# Altium schematic sheet MCU.SchDoc
size A3; SheetNumber: 3; SheetTotal: 9
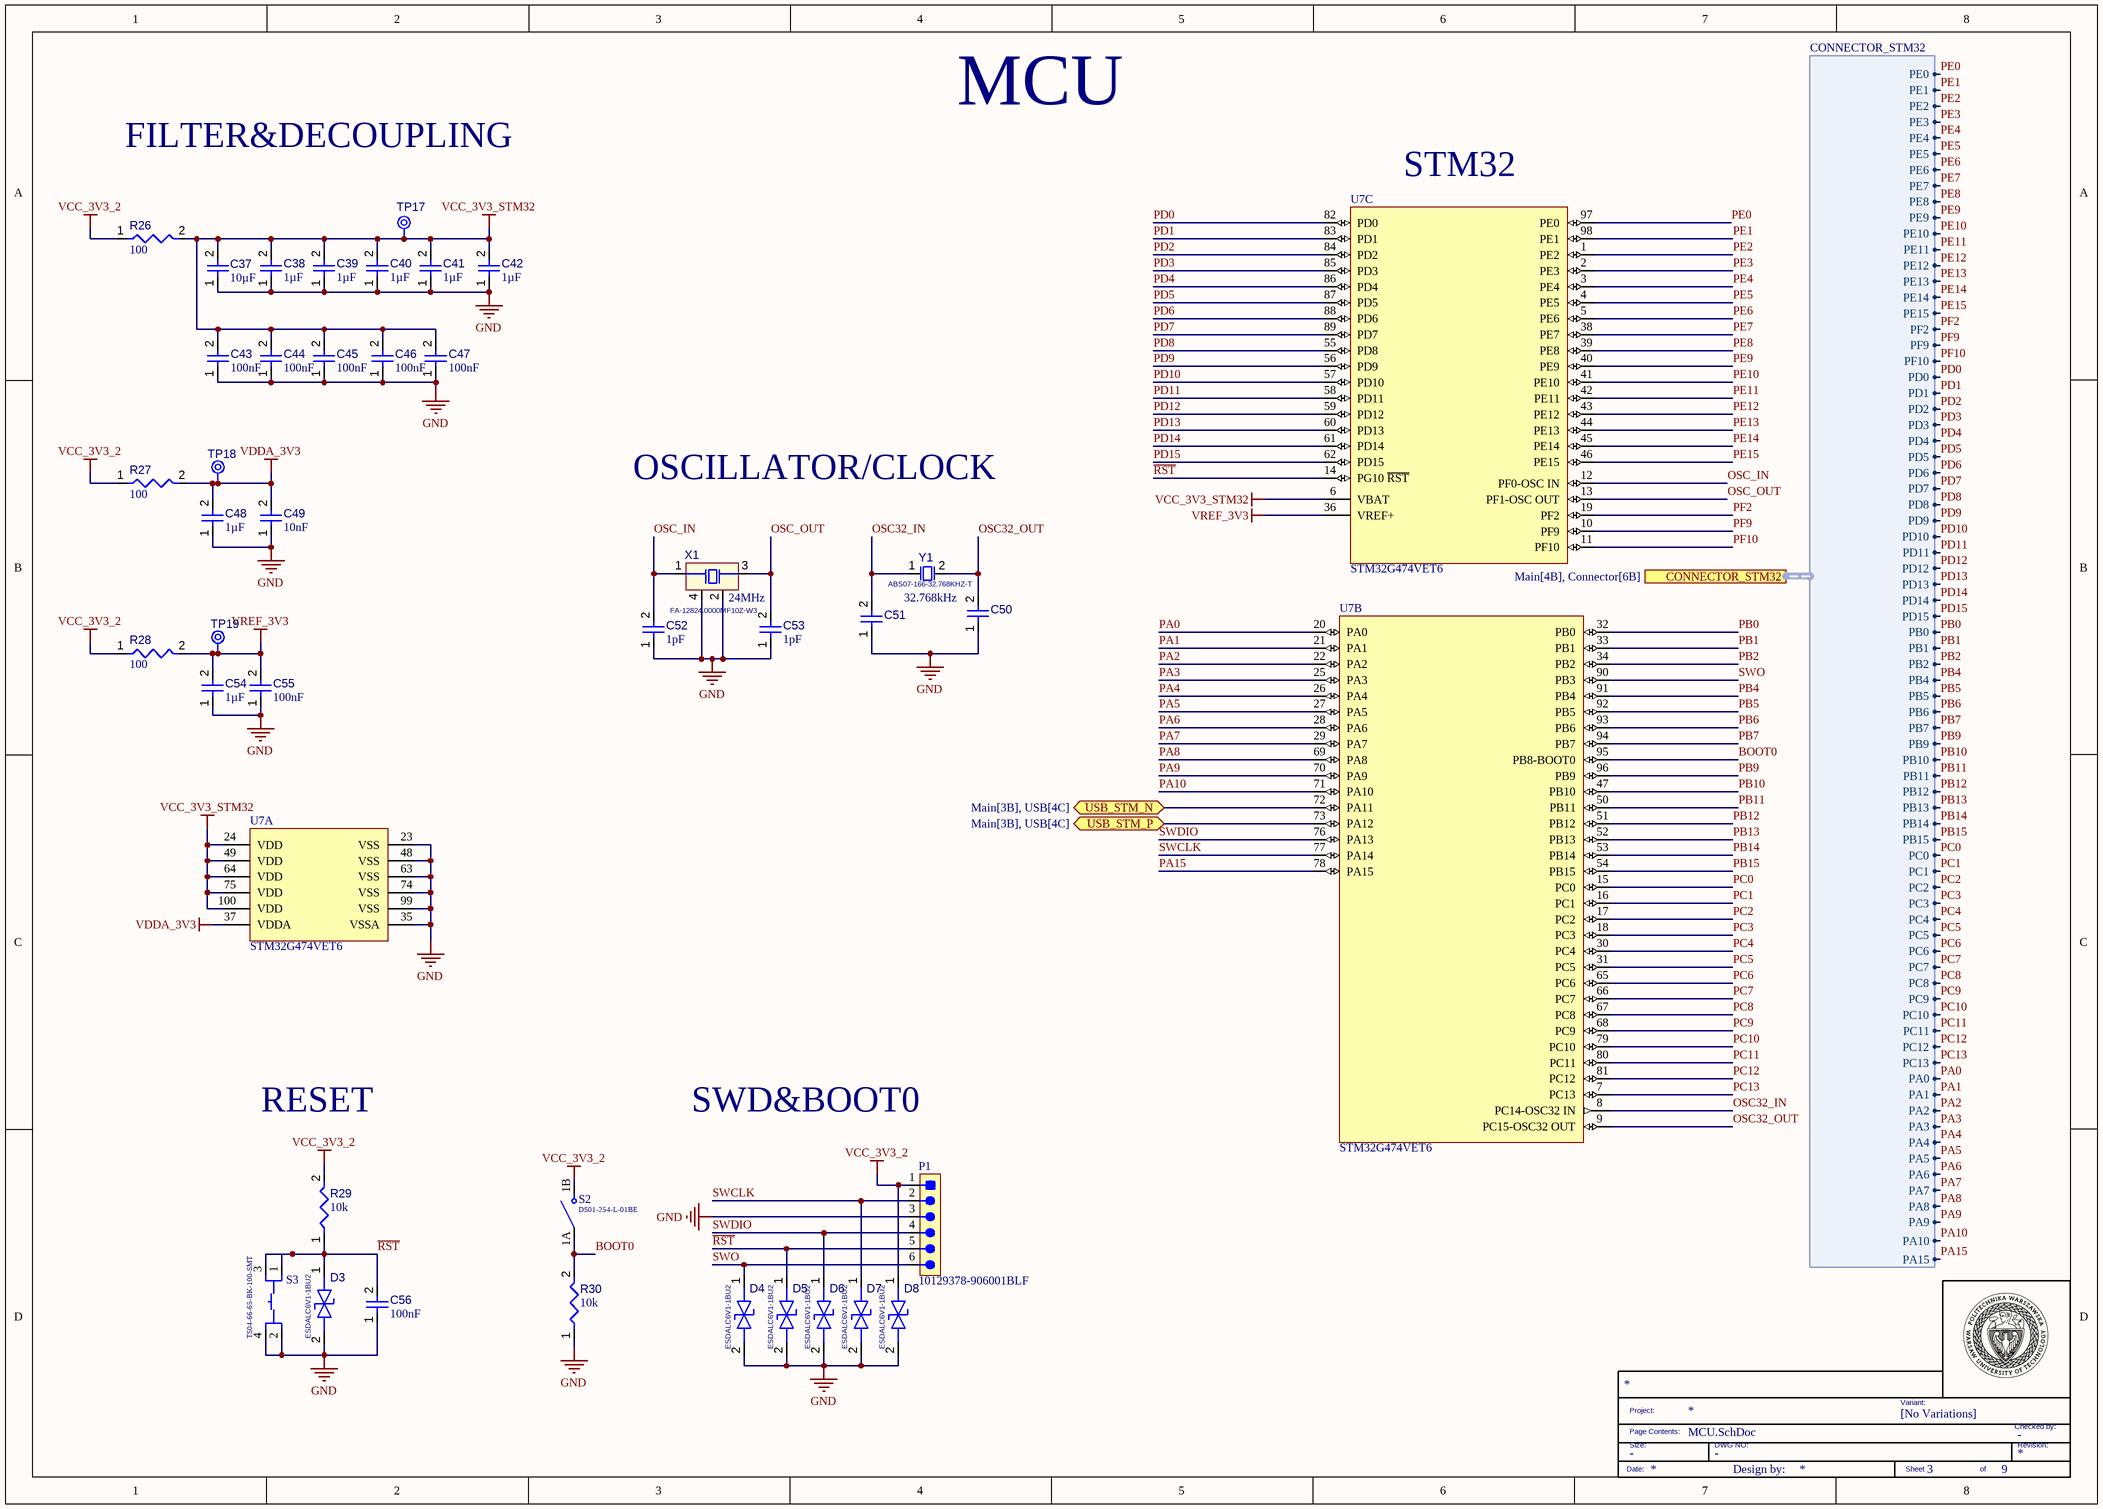
[diagram p0: MCU.SchDoc]

## Parts
*?  TITLE_BLOCK  (value not drawn)  (graphical)
C37  value 10µF  [FP-GRM188-0_2-IPC_C]  (hidden comment: GRM188R61C106MA73D)
C38  value 1µF  [FP-CL10-IPC_C]  (hidden comment: CL10B105KA8NFNC)
C39  value 1µF  [FP-CL10-IPC_C]  (hidden comment: CL10B105KA8NFNC)
C40  value 1µF  [FP-CL10-IPC_C]  (hidden comment: CL10B105KA8NFNC)
C41  value 1µF  [FP-CL10-IPC_C]  (hidden comment: CL10B105KA8NFNC)
C42  value 1µF  [FP-CL10-IPC_C]  (hidden comment: CL10B105KA8NFNC)
C43  value 100nF  [FP-C0603C-CF-IPC_C]  (hidden comment: C0603C104K5RAC7411)
C44  value 100nF  [FP-C0603C-CF-IPC_C]  (hidden comment: C0603C104K5RAC7411)
C45  value 100nF  [FP-C0603C-CF-IPC_C]  (hidden comment: C0603C104K5RAC7411)
C46  value 100nF  [FP-C0603C-CF-IPC_C]  (hidden comment: C0603C104K5RAC7411)
C47  value 100nF  [FP-C0603C-CF-IPC_C]  (hidden comment: C0603C104K5RAC7411)
C48  value 1µF  [FP-CL10-IPC_C]  (hidden comment: CL10B105KA8NFNC)
C49  value 10nF  [CAPC1608X90X35LL10T15]  (hidden comment: GCM188R71H103KA37J)
C50  C0402C479D8HACAUTO  [FP-C0402-BB-MFG]  (value not drawn)
C51  C0402C479D8HACAUTO  [FP-C0402-BB-MFG]  (value not drawn)
C52  value 1pF  [CAPC1005X06N]  (hidden comment: CBR04C109B5GACAUTO)
C53  value 1pF  [CAPC1005X06N]  (hidden comment: CBR04C109B5GACAUTO)
C54  value 1µF  [FP-CL10-IPC_C]  (hidden comment: CL10B105KA8NFNC)
C55  value 100nF  [FP-C0603C-CF-IPC_C]  (hidden comment: C0603C104K5RAC7411)
C56  value 100nF  [FP-C0603C-CF-IPC_C]  (hidden comment: C0603C104K5RAC7411)
D3  ESDALC6V1-1BU2  [DIOC0603X03N]
D4  ESDALC6V1-1BU2  [DIOC0603X03N]
D5  ESDALC6V1-1BU2  [DIOC0603X03N]
D6  ESDALC6V1-1BU2  [DIOC0603X03N]
D7  ESDALC6V1-1BU2  [DIOC0603X03N]
D8  ESDALC6V1-1BU2  [DIOC0603X03N]
P1  10129378-906001BLF  [10129378-906001BLF-Footprint-1]
R26  value 100  [RESC1608X06N]  (hidden comment: CRCW0603100RFKEAHP)
R27  value 100  [RESC1608X06N]  (hidden comment: CRCW0603100RFKEAHP)
R28  value 100  [RESC1608X06N]  (hidden comment: CRCW0603100RFKEAHP)
R29  value 10k  [RESC1608X05N]  (hidden comment: CRCW060310K0FKTC)
R30  value 10k  [RESC1608X05N]  (hidden comment: CRCW060310K0FKTC)
S2  DS01-254-L-01BE  [SW_DS01-254-L-01BE]
S3  TS04-66-65-BK-100-SMT  [SW_TS04-66-65-BK-100-SMT]
TP17  TPAD6R  [TP06R]  (value not drawn)  (no BOM)
TP18  TPAD6R  [TP06R]  (value not drawn)  (no BOM)
TP19  TPAD6R  [TP06R]  (value not drawn)  (no BOM)
U7  STM32G474VET6  [FP-LQFP100-1L-IPC_B]  (parts A,B,C of 3)
X1  FA-12824.0000MF10Z-W3  Frequency: 24MHz  [EPSON-FA-128_V]
Y1  ABS07-166-32.768KHZ-T  Frequency: 32.768kHz  [EPSON-FC-135_V]

## Ports
CONNECTOR_STM32 (harness CONNECTOR_STM32, see Main[4B], Connector[6B]), USB_STM_N (bidir, see Main[3B], USB[4C]), USB_STM_P (bidir, see Main[3B], USB[4C])

## Harnesses
CONNECTOR_STM32: PE0, PE1, PE2, PE3, PE4, PE5, PE6, PE7, PE8, PE9, PE10, PE11, PE12, PE13, PE14, PE15, PF2, PF9, PF10, PD0, PD1, PD2, PD3, PD4, PD5, PD6, PD7, PD8, PD9, PD10, PD11, PD12, PD13, PD14, PD15, PB0, PB1, PB2, PB4, PB5, PB6, PB7, PB9, PB10, PB11, PB12, PB13, PB14, PB15, PC0, PC1, PC2, PC3, PC4, PC5, PC6, PC7, PC8, PC9, PC10, PC11, PC12, PC13, PA0, PA1, PA2, PA3, PA4, PA5, PA6, PA7, PA8, PA9, PA10, PA15

## Nets
GND: C37.1 C38.1 C39.1 C40.1 C41.1 C42.1 C43.1 C44.1 C45.1 C46.1 C47.1 C48.1 C49.1 C50.1 C51.1 C52.1 C53.1 C54.1 C55.1 C56.1 D3.2(A) D4.2(A) D5.2(A) D6.2(A) D7.2(A) D8.2(A) P1.3 R30.1 S3.2 S3.4 U7.23(VSS) U7.35(VSSA) U7.48(VSS) U7.63(VSS) U7.74(VSS) U7.99(VSS) X1.2(NC) X1.4(NC)
VCC_3V3_2: D8.1(K) P1.1 R26.1 R27.1 R28.1 R29.2 S2.1B(NO1)
VCC_3V3_STM32: C37.2 C38.2 C39.2 C40.2 C41.2 C42.2 C43.2 C44.2 C45.2 C46.2 C47.2 R26.2 TP17.1(TP) U7.6(VBAT) U7.24(VDD) U7.49(VDD) U7.64(VDD) U7.75(VDD) U7.100(VDD)
VDDA_3V3: C48.2 C49.2 R27.2 TP18.1(TP) U7.37(VDDA)
VREF_3V3: C54.2 C55.2 R28.2 TP19.1(TP) U7.36(VREF+)
~{RST}: C56.2 D3.1(K) D5.1(K) P1.5 R29.1 S3.1 S3.3 U7.14(PG10_~{RST})
BOOT0: R30.2 S2.1A(COM1) U7.95(PB8-BOOT0)
OSC32_IN: C51.2 U7.8(PC14-OSC32_IN) Y1.1
OSC32_OUT: C50.2 U7.9(PC15-OSC32_OUT) Y1.2
OSC_IN: C52.2 U7.12(PF0-OSC_IN) X1.1(X1)
OSC_OUT: C53.2 U7.13(PF1-OSC_OUT) X1.3(X2)
PA0: U7.20(PA0) ; port CONNECTOR_STM32.PA0
PA1: U7.21(PA1) ; port CONNECTOR_STM32.PA1
PA2: U7.22(PA2) ; port CONNECTOR_STM32.PA2
PA3: U7.25(PA3) ; port CONNECTOR_STM32.PA3
PA4: U7.26(PA4) ; port CONNECTOR_STM32.PA4
PA5: U7.27(PA5) ; port CONNECTOR_STM32.PA5
PA6: U7.28(PA6) ; port CONNECTOR_STM32.PA6
PA7: U7.29(PA7) ; port CONNECTOR_STM32.PA7
PA8: U7.69(PA8) ; port CONNECTOR_STM32.PA8
PA9: U7.70(PA9) ; port CONNECTOR_STM32.PA9
PA10: U7.71(PA10) ; port CONNECTOR_STM32.PA10
PA15: U7.78(PA15) ; port CONNECTOR_STM32.PA15
PB0: U7.32(PB0) ; port CONNECTOR_STM32.PB0
PB1: U7.33(PB1) ; port CONNECTOR_STM32.PB1
PB2: U7.34(PB2) ; port CONNECTOR_STM32.PB2
PB4: U7.91(PB4) ; port CONNECTOR_STM32.PB4
PB5: U7.92(PB5) ; port CONNECTOR_STM32.PB5
PB6: U7.93(PB6) ; port CONNECTOR_STM32.PB6
PB7: U7.94(PB7) ; port CONNECTOR_STM32.PB7
PB9: U7.96(PB9) ; port CONNECTOR_STM32.PB9
PB10: U7.47(PB10) ; port CONNECTOR_STM32.PB10
PB11: U7.50(PB11) ; port CONNECTOR_STM32.PB11
PB12: U7.51(PB12) ; port CONNECTOR_STM32.PB12
PB13: U7.52(PB13) ; port CONNECTOR_STM32.PB13
PB14: U7.53(PB14) ; port CONNECTOR_STM32.PB14
PB15: U7.54(PB15) ; port CONNECTOR_STM32.PB15
PC0: U7.15(PC0) ; port CONNECTOR_STM32.PC0
PC1: U7.16(PC1) ; port CONNECTOR_STM32.PC1
PC2: U7.17(PC2) ; port CONNECTOR_STM32.PC2
PC3: U7.18(PC3) ; port CONNECTOR_STM32.PC3
PC4: U7.30(PC4) ; port CONNECTOR_STM32.PC4
PC5: U7.31(PC5) ; port CONNECTOR_STM32.PC5
PC6: U7.65(PC6) ; port CONNECTOR_STM32.PC6
PC7: U7.66(PC7) ; port CONNECTOR_STM32.PC7
PC8: U7.67(PC8) ; port CONNECTOR_STM32.PC8
PC9: U7.68(PC9) ; port CONNECTOR_STM32.PC9
PC10: U7.79(PC10) ; port CONNECTOR_STM32.PC10
PC11: U7.80(PC11) ; port CONNECTOR_STM32.PC11
PC12: U7.81(PC12) ; port CONNECTOR_STM32.PC12
PC13: U7.7(PC13) ; port CONNECTOR_STM32.PC13
PD0: U7.82(PD0) ; port CONNECTOR_STM32.PD0
PD1: U7.83(PD1) ; port CONNECTOR_STM32.PD1
PD2: U7.84(PD2) ; port CONNECTOR_STM32.PD2
PD3: U7.85(PD3) ; port CONNECTOR_STM32.PD3
PD4: U7.86(PD4) ; port CONNECTOR_STM32.PD4
PD5: U7.87(PD5) ; port CONNECTOR_STM32.PD5
PD6: U7.88(PD6) ; port CONNECTOR_STM32.PD6
PD7: U7.89(PD7) ; port CONNECTOR_STM32.PD7
PD8: U7.55(PD8) ; port CONNECTOR_STM32.PD8
PD9: U7.56(PD9) ; port CONNECTOR_STM32.PD9
PD10: U7.57(PD10) ; port CONNECTOR_STM32.PD10
PD11: U7.58(PD11) ; port CONNECTOR_STM32.PD11
PD12: U7.59(PD12) ; port CONNECTOR_STM32.PD12
PD13: U7.60(PD13) ; port CONNECTOR_STM32.PD13
PD14: U7.61(PD14) ; port CONNECTOR_STM32.PD14
PD15: U7.62(PD15) ; port CONNECTOR_STM32.PD15
PE0: U7.97(PE0) ; port CONNECTOR_STM32.PE0
PE1: U7.98(PE1) ; port CONNECTOR_STM32.PE1
PE2: U7.1(PE2) ; port CONNECTOR_STM32.PE2
PE3: U7.2(PE3) ; port CONNECTOR_STM32.PE3
PE4: U7.3(PE4) ; port CONNECTOR_STM32.PE4
PE5: U7.4(PE5) ; port CONNECTOR_STM32.PE5
PE6: U7.5(PE6) ; port CONNECTOR_STM32.PE6
PE7: U7.38(PE7) ; port CONNECTOR_STM32.PE7
PE8: U7.39(PE8) ; port CONNECTOR_STM32.PE8
PE9: U7.40(PE9) ; port CONNECTOR_STM32.PE9
PE10: U7.41(PE10) ; port CONNECTOR_STM32.PE10
PE11: U7.42(PE11) ; port CONNECTOR_STM32.PE11
PE12: U7.43(PE12) ; port CONNECTOR_STM32.PE12
PE13: U7.44(PE13) ; port CONNECTOR_STM32.PE13
PE14: U7.45(PE14) ; port CONNECTOR_STM32.PE14
PE15: U7.46(PE15) ; port CONNECTOR_STM32.PE15
PF2: U7.19(PF2) ; port CONNECTOR_STM32.PF2
PF9: U7.10(PF9) ; port CONNECTOR_STM32.PF9
PF10: U7.11(PF10) ; port CONNECTOR_STM32.PF10
SWCLK: D7.1(K) P1.2 U7.77(PA14)
SWDIO: D6.1(K) P1.4 U7.76(PA13)
SWO: D4.1(K) P1.6 U7.90(PB3)
USB_STM_N: U7.72(PA11) ; port USB_STM_N
USB_STM_P: U7.73(PA12) ; port USB_STM_P

## Notes on the sheet
- FILTER&DECOUPLING
- MCU
- (near U7) STM32
- OSCILLATOR/CLOCK
- Battery not used
- RESET
- SWD&BOOT0
- (in symbol CMP-003-000005-7) Variant:; Project:; [No Variations]; Checked by:; Page Contents:; Size:; DWG NO:; Revision:; Date:; Design by:; Sheet; of

## Library data of the parts
*? = CMP-003-000005-7: TITLEBLOCK; DWG NO: -; Size: -; Checked by: -; Design Item ID: TITLE_BLOCK; Source: TITLEBLOCK.SchLib
C37 = CMP-001-00241-5: Ceramic Capacitor, Multilayer, Ceramic, 16V, 20% +Tol, 20% -Tol, X5R, 15% TC, 10uF, Surface Mount, 0603; Min Operating Temperature: -55°C; Capacitor Type: Ceramic; RoHS Compliant: Yes; Max Operating Temperature: 85°C; Case/Package: 0603; Mounting Technology: Surface Mount; Pins: 2
C38-C42 C48 C54 = CMP-001-00085-5: Ceramic Capacitor, Multilayer, Ceramic, 25V, 10% +Tol, 10% -Tol, X7R, 15% TC, 1uF, Surface Mount, 0603; Max Operating Temperature: 125°C; Pins: 2; RoHS Compliant: Yes; Min Operating Temperature: -55°C; Capacitor Type: Ceramic; Mounting Technology: Surface Mount; Case/Package: 0603
C43-C47 C55 C56 = CMP-001-00086-8: Ceramic Capacitor, Multilayer, Ceramic, 50V, 10% +Tol, 10% -Tol, X7R, 15% TC, 0.1uF, Surface Mount, 0603; Capacitor Type: Ceramic; Max Operating Temperature: 125°C; Case/Package: 0603; Pins: 2; Min Operating Temperature: -55°C; RoHS Compliant: Yes; Mounting Technology: Surface Mount
C49 = CMP-001-00231-2: Ceramic Capacitor, Multilayer, Ceramic, 50V, 10% +Tol, 10% -Tol, X7R, 15% TC, 0.01uF, Surface Mount, 0603; Min Operating Temperature: -55°C; Voltage Rating: 50V; Max Operating Temperature: 125°C; Tolerance: 10%; Capacitor Type: Ceramic; Mounting Technology: Surface Mount; RoHS Compliant: Yes; Case/Package: 0603; Pins: 2
C50 C51 = CMP-001-00239-1: Cap Cer 0402 4.7PF 10V Ultra Sta; RoHS Compliant: Yes
C52 C53 = CMP-001-00240-1: Cap Cer 1PF 50V C0G/NP0 0402; Capacitor Type: NP0; Tolerance: 10%; Pins: 2; Voltage Rating: 50V; Max Operating Temperature: 125°C; Case/Package: 0402; Min Operating Temperature: -55°C
D3-D8 = CMP-004-00032-2: Trans Voltage Suppressor Diode, Bidirectional, 1 Element, Silicon; Forward Current: 100nA; Peak Inverse Voltage: 6.1V; Forward Voltage: 3V; Max Surge Current: 1.5A; Max Operating Temperature: 125°C; Min Operating Temperature: -40°C; Case/Package: 0201; Pins: 2; RoHS Compliant: Yes
P1 = CMP-002-00071-1: Headers & Wire Housings ECONOSTIK HEADER SR VT TH 1X6; Connector Type: Pin Strip; Voltage Rating: 110V; Gender: Male; Max Current Rating: 3A; Pins: 6; Max Operating Temperature: -40°C; Min Operating Temperature: 105°C
R26-R28 = CMP-009-00188-2: Fixed Resistor, Metal Glaze/thick Film, 0.33W, 100ohm, 75V, 1% +/-Tol, 100ppm/Cel, Surface Mount, 0603; Power: 250mW; Pins: 2; Case/Package: 0603; Max Operating Temperature: 155°C; Tolerance: 1%; Min Operating Temperature: -55°C; Mounting Technology: Surface Mount; RoHS Compliant: Yes
R29 R30 = CMP-009-00187-2: Fixed Resistor, Metal Glaze/thick Film, 0.1W, 10000ohm, 75V, 1% +/-Tol, 100ppm/Cel, Surface Mount, 0603; Power: 100mW; Voltage Rating: 75V; Case/Package: 0603; Tolerance: 1%; Min Operating Temperature: -55°C; Mounting Technology: Surface Mount; Max Operating Temperature: 155°C; RoHS Compliant: No; Pins: 2
S2 = CMP-011-00013-2: 1 Position, Through Hole, 2.54 mm Pitch, Raised Slide Actuator, Flat Bottom, Long Pin, DIP Switch; MF: CUI Devices; SnapEDA_Link: https://www.snapeda.com/parts/DS01-254-L-01BE/CUI+Devices/view-part/?ref=snap; Purchase-URL: https://pricing.snapeda.com/search/part/DS01-254-L-01BE/?ref=eda; Price: None; Value: *; MP: DS01-254-L-01BE; Component Type: Standard; CUI_purchase_URL: https://www.cuidevices.com/product/switches/dip-switches/ds01-254-series?utm_source=snapeda.com&utm_medium=referral&utm_campaign=snapedaBOM; Case/Package: None; Design Item ID: DS01-254-L-01BE; Pins: 2; Check_prices: https://www.snapeda.com/parts/DS01-254-L-01BE/CUI+Devices/view-part/?ref=eda; Source: DS01-254-L-01BE.SchLib; Availability: In Stock
S3 = CMP-015-000000-3: Switch Tactile OFF (ON) SPST Round Button Gull Wing 0.05A 12VDC 100000Cycles 1N SMD Bag; Package: None; MP: TS04-66-65-BK-100-SMT; Availability: Unavailable; Source: TS04-66-65-BK-100-SMT.SchLib; Pin Count: 4; Design Item ID: TS04-66-65-BK-100-SMT; Value: *; Component Type: Standard; Price: None
TP17-TP19 = CMP-00028-00002-3: 0.6mm round; Pins: 1
U7 = CMP-020-00023-3: Microcontroller; Clock Frequency: 170MHz; RAM Size: 128; I/Os: 107; Max Supply Voltage: 3.6V; Nominal Supply Voltage: 3.3V; Min Supply Voltage: 1.71V; Min Operating Temperature: -40°C; RoHS Compliant: Yes; Case/Package: LQFP-100
X1 = CMP-003-00028-3: Crystal, 24 MHz, +/- 10 ppm, -20 to 75 degC, 4-Pin SMD, RoHS, Tape and Reel; ESR: 80; Load Capacitance: 12pF; RoHS Compliant: Yes; Case/Package: SMD/SMT; Mounting Technology: SMT; Min Operating Temperature: -20°C; Pins: 4; Max Operating Temperature: 75°C
Y1 = CMP-003-00029-2: Crystal 32.768kHz 10ppm 7pF -40C +85C; Pins: 2